# EAGLE design dc-isolation (EAGLE 5.07)
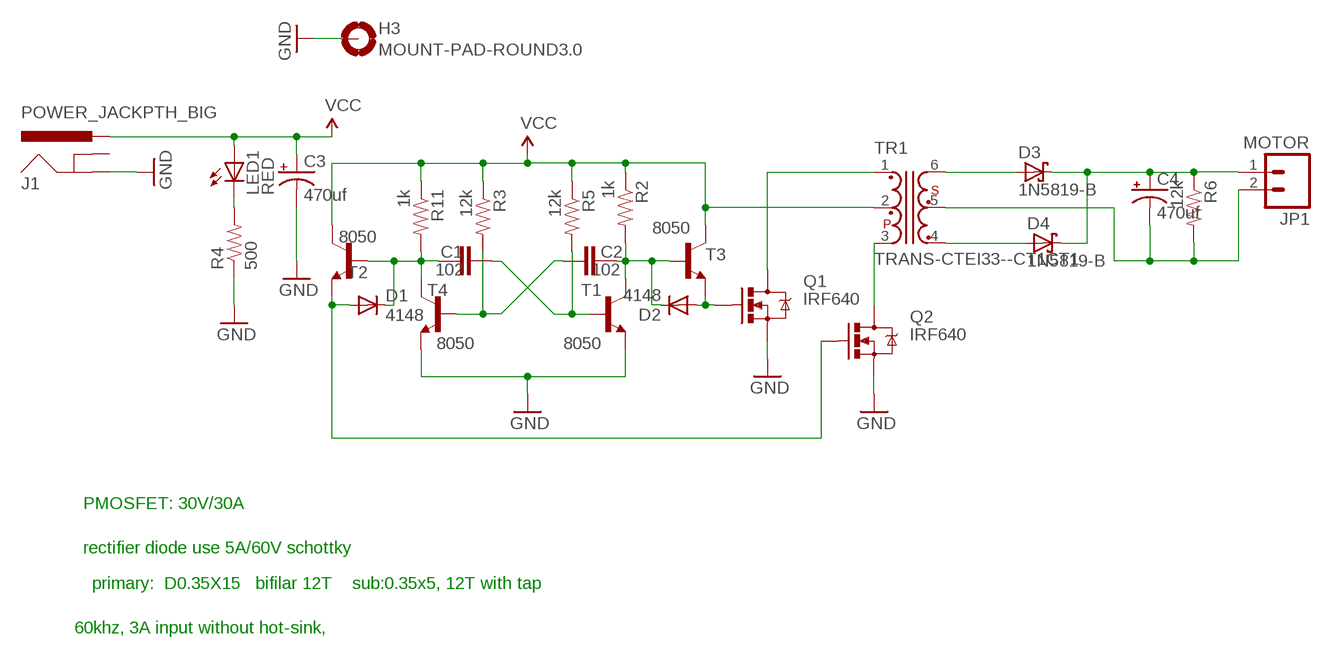
[diagram p0: schematic, sheet 1]

## Parts
C1  102  CAPPTH  [CAP-PTH-SMALL]
C2  102  CAPPTH  [CAP-PTH-SMALL]
C3  470uf  CAP_POLPTH1  [CPOL-RADIAL-100UF-25V]
C4  470uf  CAP_POLPTH1  [CPOL-RADIAL-100UF-25V]
D1  4148  DIODE1N4148  [DIODE-1N4148]
D2  4148  DIODE1N4148  [DIODE-1N4148]
D3  1N5819-B  [DO41-7.6]
D4  1N5819-B  [DO41-7.6]
H3  MOUNT-PAD-ROUND3.0  [3,0-PAD]
J1  POWER_JACKPTH_BIG  [POWER_JACK_2.1X5.5_BIG_PTH]
JP1  MOTOR  CON-02-XH  [XH-1X2-LONG-LOCK]
LED1  RED  LED3MM  [LED3MM]
Q1  IRF640  -MOSFET-N-TO220BV  [MOSFET-TO220BV]
Q2  IRF640  -MOSFET-N-TO220BV  [MOSFET-TO220BV]
R2  1k  RESISTOR1/4W  [AXIAL-0.3]
R3  12k  RESISTOR1/4W  [AXIAL-0.3]
R4  500  RESISTOR1/4W  [AXIAL-0.3]
R5  12k  RESISTOR1/4W  [AXIAL-0.3]
R6  12k  RESISTOR1/4W  [AXIAL-0.3]
R11  1k  RESISTOR1/4W  [AXIAL-0.3]
T1  8050  90**-NPN-TO92-EBC  [TO92-EBC]
T2  8050  90**-NPN-TO92-EBC  [TO92-EBC]
T3  8050  90**-NPN-TO92-EBC  [TO92-EBC]
T4  8050  90**-NPN-TO92-EBC  [TO92-EBC]
TR1  TRANS-CTEI33--CT1CT1  [EI33-PT1W-ST1W]

## Nets
GND: C3.2(-) H3.B3,0(MOUNT) J1.GND Q1.S Q2.S R4.P$1 T1.E T4.E
N$1: LED1.K(C) R4.P$2
N$2: D1.A Q2.G T2.E
N$3: Q1.D TR1.1
N$6: C1.1 D1.C R11.P$2 T2.B T4.C
N$7: Q2.D TR1.3
N$8: C2.1 R3.P$2 T4.B
N$9: C1.2 R5.P$2 T1.B
N$10: C2.2 D2.C R2.P$2 T1.C T3.B
N$11: D2.A Q1.G T3.E
N$13: D3.A TR1.6
N$14: C4.2(-) JP1.2 R6.P$2 TR1.5
N$15: C4.1(+) D3.C D4.C JP1.1 R6.P$1
N$16: D4.A TR1.4
VCC: C3.1(+) J1.PWR LED1.A R2.P$1 R3.P$1 R5.P$1 R11.P$1 T2.C T3.C TR1.2
Unconnected: J1.GNDBREAK

## Notes on the sheet
- PMOSFET: 30V/30A
- rectifier diode use 5A/60V schottky
- primary:  D0.35X15   bifilar 12T    sub:0.35x5, 12T with tap
- 60khz, 3A input without hot-sink,

## Library data of the parts
C1 C2 = digital-toy:CAP: Capacitor Standard 0603 ceramic capacitor, and 0.1" leaded capacitor.
C3 C4 = digital-toy:CAP_POL: Capacitor Polarized These are standard SMD and PTH capacitors. Normally 10uF, 47uF, and 100uF in electrolytic and tantalum varieties. Always verify the external diameter of the through hole cap, it varies with capacity, voltage, and manufacturer. The EIA devices should be standard. PANASONIC_D size: 6.5mmx6.5mmx5.5mm, 100uf (taobao:6.3mmx5.5mm), same as CVL0605 153cvl0405 size: 4mmx4mmx5.5mm, 10uf (taobao:4mmx5.5mm)
D1 D2 = digital-toy:DIODE: Diode These are standard reverse protection diodes and small signal diodes. SMA package can handle up to about 1A. SOD-323 can handle about 200mA. What the SOD-323 package when ordering, there are some mfgs out there that are 5-pin packages.
D3 D4 = digital-toy:1N581*: 1.0A SCHOTTKY BARRIER RECTIFIER Source: http://www.diodes.com/datasheets/ds23001.pdf
H3 = holes:MOUNT-PAD-ROUND: MOUNTING PAD, round
J1 = digital-toy:POWER_JACK: Power Jack This is the standard 5.5mm barrel jack for power. The PTH is the most common, proven, reliable, footprint. All others are experimental. The Slot footprint only works if the mill layer is transmitted to the PCB fab house so be warned. Spark Fun Electronics SKU : PRT-00119. Mating wall wart : TOL-00298 (and others)
JP1 = digital-toy:CON-02: Header 2 Standard 2-pin 0.1" header. Use with straight break away headers (SKU : PRT-00116), right angle break away headers (PRT-00553), swiss pins (PRT-00743), machine pins (PRT-00117), and female headers (PRT-00115). Molex polarized connector foot print use with SKU : PRT-08233 with associated crimp pins and housings.
LED1 = digital-toy:LED: LEDs Standard schematic elements and footprints for 5mm, 3mm, 1206, and 0603 sized LEDs. 5mm - Spark Fun Electronics SKU : COM-00529 (and others) copy led.lbr 0805 led here, by hyl digital-toy. 2010.6.29
Q1 Q2 = digital-toy:*-MOSFET-N
R2-R6 R11 = digital-toy:RESISTOR: Resistor Basic schematic elements and footprints for 0603, 1206, and PTH 1/10th watt (small) resistors. digital-toy copy vertical mount of axial-0.3 from rcl.lbr : the 0207/xx
T1-T4 = digital-toy:*-NPN-: NPN Transistror most of sot-23 use the pacages sot23-BEC, top C, left B, right E. by hyl, digital-toy. and to-92 use ebc(from-top) by hyl, digital-toy.
TR1 = digital-toy:TRANS-CT

## Board
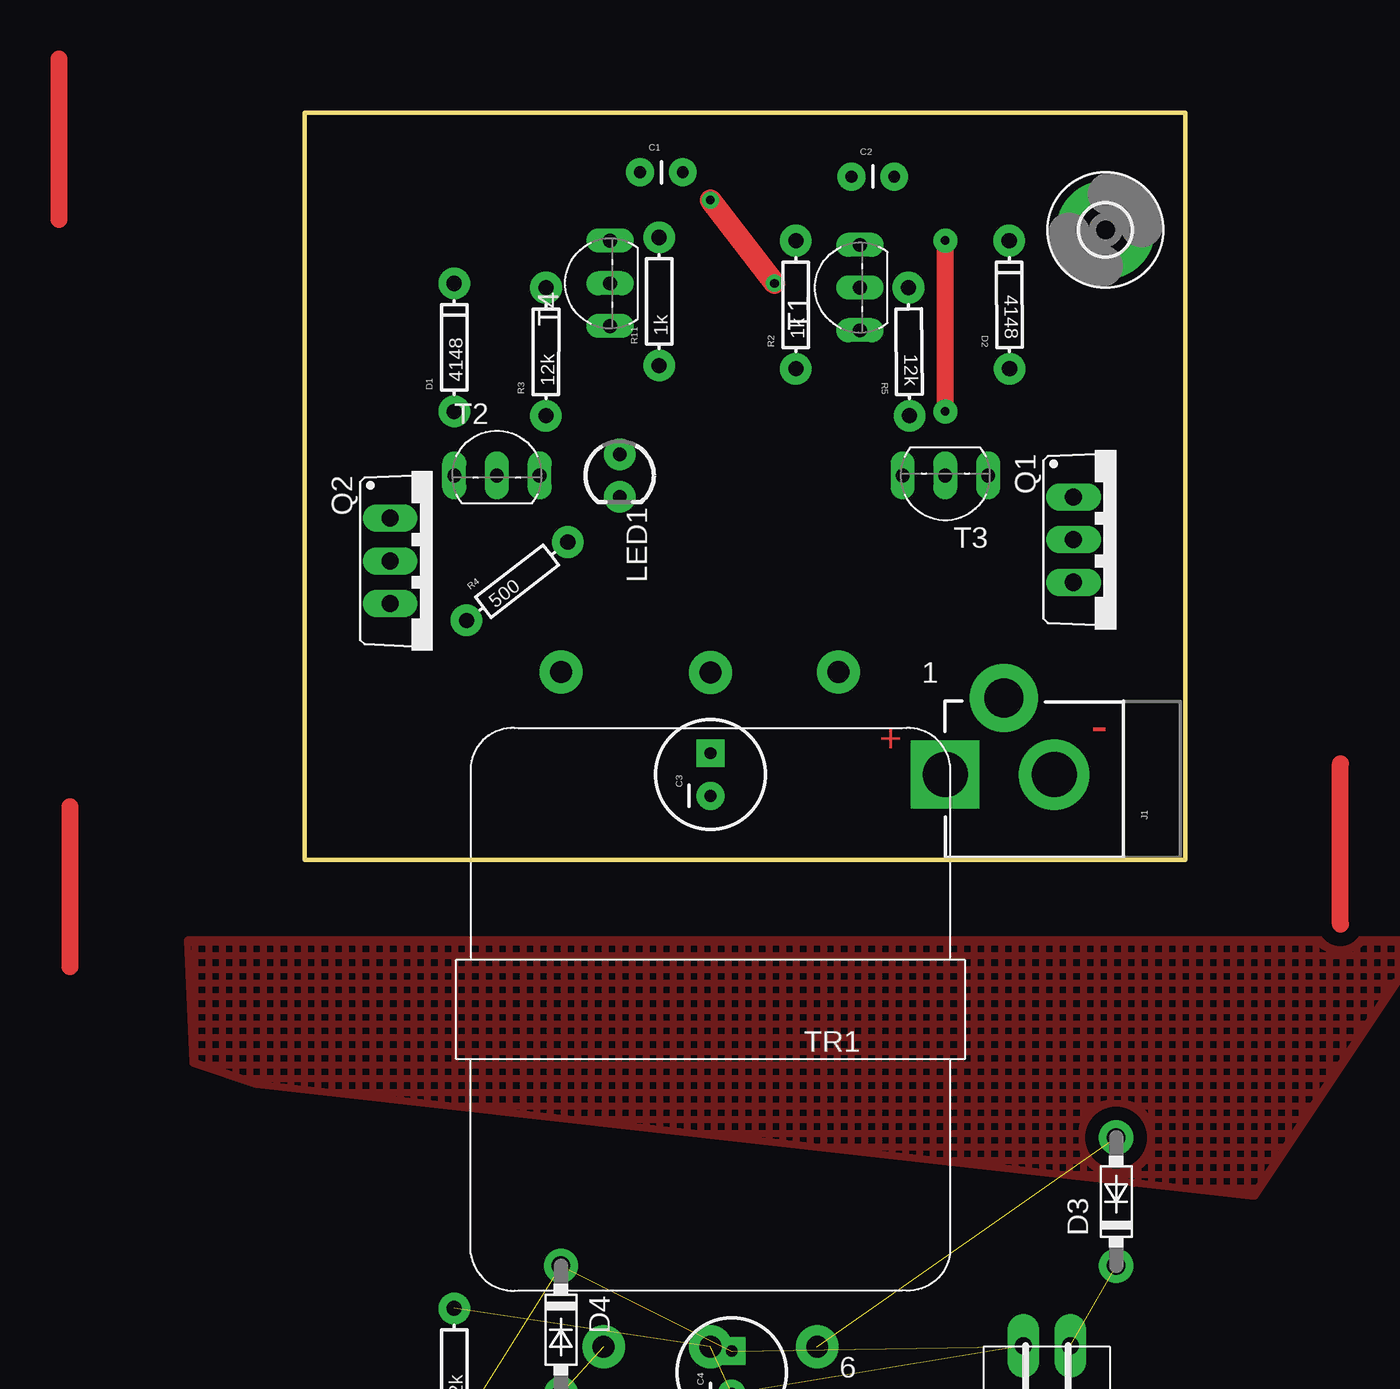
[diagram p1: board, top side]
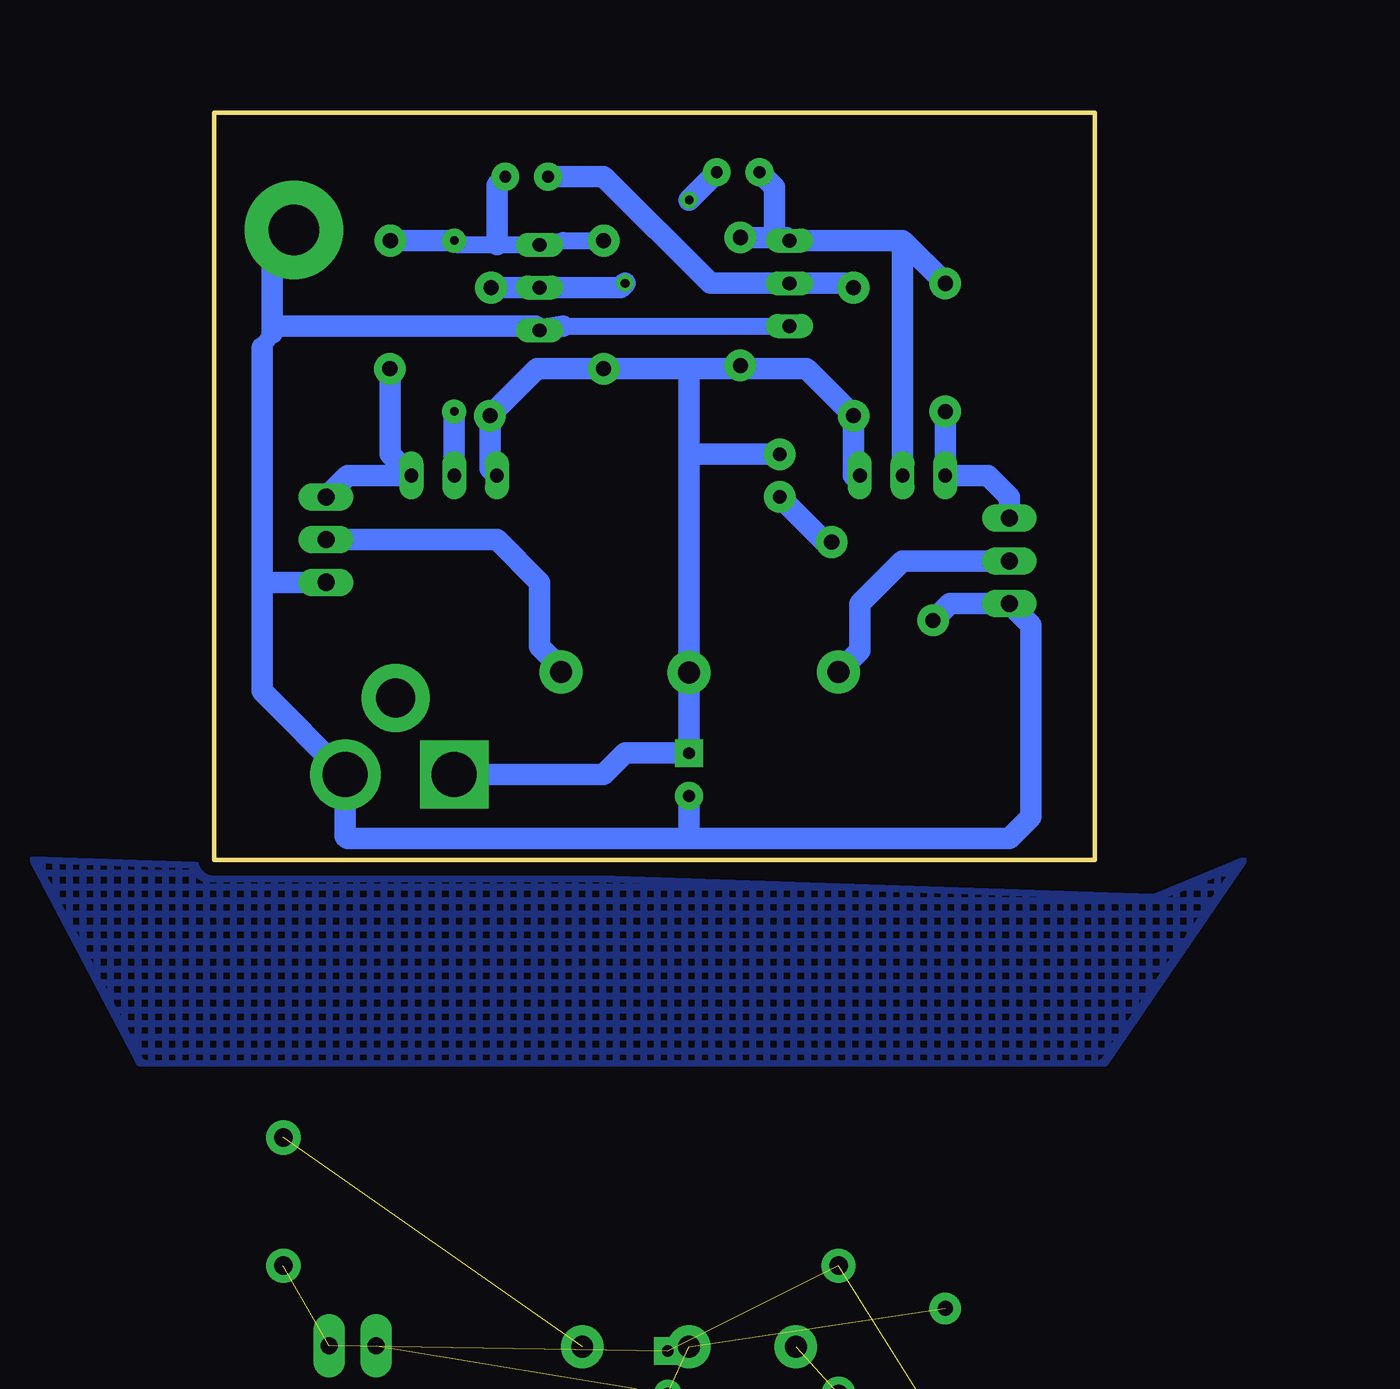
[diagram p2: board, bottom side, seen from below]

Size 52.39 x 44.45 mm. Coordinates in mm from the lower left corner, seen from the top.
Outline: 0,0 52.39,0 52.39,44.45 0,44.45 0,0
Copper layers (1*16): Top 0.035mm / dielectric 1.5mm / Bottom 0.035mm
Design rules "SparkFun-HP1007-600x600dpi": minimum track width 10mil, minimum drill 20mil, track to track 12mil, track to pad 12mil, pad to pad 12mil, via to via 12mil, smd to smd 12mil, copper to edge 12mil, drill to drill 12mil, minimum pad ring 12mil, minimum via ring 10mil, stop-mask expansion 4mil, vias tented up to drill 25mil, thermal gap 10mil

### Footprints (pad centres in the part's own frame; a part is rotated, then mirrored left to right if it is on the bottom)
CAP-PTH-SMALL = drill 0.7 pad 1.651 round: 1 0,0; 2 2.54,0
CPOL-RADIAL-100UF-25V = drill 0.7 pad 1.651 square: 1 1.27,0 | drill 0.7 pad 1.651 round: 2 -1.27,0
DIODE-1N4148 = drill 0.9 pad 1.88 round: A -3.81,0; C 3.81,0
DO41-7.6 = drill 1.1 pad 2.032 round: A 3.81,0; C -3.81,0
3,0-PAD = drill 3 pad 5.842 round: B3,0 0,0
POWER_JACK_2.1X5.5_BIG_PTH = drill 2.667 pad 4.191 round: GND 0,-0.127 | drill 2.337 pad 4.064 round: GNDBREAK 4.547,2.87 | drill 2.667 pad 4.064 square: PWR 0,6.35
XH-1X2-LONG-LOCK = drill 1.016 pad 1.88 long: 1 -1.397,0; 2 1.397,0
LED3MM = drill 0.813 pad 1.88 round: A -1.27,0; K 1.27,0
MOSFET-TO220BV = drill 1.016 long: D 0,-2.54; G -2.54,-2.54; S 2.54,-2.54
AXIAL-0.3 = drill 0.9 pad 1.88 round: P$1 -3.81,0; P$2 3.81,0
TO92-EBC = drill 0.813 long: B 0,-1.27; C 2.54,-1.27; E -2.54,-1.27
EI33-PT1W-ST1W = drill 1.3 pad 2.54 round: 1 -7.62,-20.066; 2 0,-20.038; 3 8.89,-20.066; 4 6.35,20.066; 5 0,20.066; 6 -6.35,20.066

### Placement (x,y rotation side)
C1  19.94,40.89 0 top
C2  32.51,40.64 0 top
C3  24.13,5.08 90 top
C4  25.4,-30.48 90 top  (outside the outline)
D1  8.89,30.48 90 top
D2  41.91,33.02 90.2 top
D3  48.26,-20.32 90 top  (outside the outline)
D4  15.24,-27.94 270 top  (outside the outline)
H3  47.62,37.47 0 top
J1  44.45,5.08 90 top
JP1  44.13,-28.89 180 top  (outside the outline)
LED1  18.73,22.86 270 top
Q1  48.26,19.05 270 top
Q2  7.62,17.78 270 top
R2  29.21,33.02 90 top
R3  14.35,30.23 89.9 top
R4  12.64,16.57 37.7 top
R5  35.94,30.23 90.5 top
R6  8.89,-30.48 90 top  (outside the outline)
R11  21.08,33.21 90 top
T1  31.75,34.04 90 top
T2  11.43,24.13 0 top
T3  38.1,21.59 180 top
T4  16.89,34.29 90 top
TR1  24.13,-8.89 180 top

### Tracks (layer width: path | path; a pad name or v marks a point on that pad's centre or on a via)
GND
  Bottom 1.016: 31.62,31.75 T4.E | 49.53,30.48 48.93,31.33
  Bottom 1.27: 31.62,31.75 T1.E 33.27,31.75 48.93,31.75 | 49.53,16.51 Q1.S | 49.53,16.51 49.53,30.48 | 49.53,16.51 49.53,10.03 J1.GND 44.58,1.4 44.45,1.27 24.13,1.27 | 24.13,1.27 5.08,1.27 3.81,2.54 3.81,13.97 Q2.S 8.62,15.24 R4.P$1 | 24.13,1.27 C3.2 | H3.B3,0 48.93,36.16 48.93,31.75 | 48.93,31.33 48.93,31.75
  pour Bottom (isolate 0.813, hatched): -3.49,-2.22 63.18,0 56.83,-12.06 -0.64,-12.06 -8.89,0
  pour Top (isolate 0.813, hatched): 56.52,-20 66.67,-4.76 -6.99,-4.76 -6.67,-12.06 -2.86,-13.34
N$1
  Bottom 1.27: R4.P$2 16.05,18.9 LED1.K
N$2
  Bottom 1.27: D1.A T2.E 6.35,22.86 5.08,21.59 Q2.G
N$3
  Bottom 1.27: Q1.D 35.56,19.05 33.02,16.51 33.02,12.7 31.75,11.43 TR1.1
N$6
  Bottom 1.27: T2.B 11.43,36.83 | 11.43,36.83 T4.C 18.35,37.02 19.05,37.02 | 11.43,36.83 D1.C | 19.05,37.02 R11.P$2 | C1.1 19.05,40.01 19.05,37.02
N$7
  Bottom 1.27: Q2.D 11.43,17.78 13.97,15.24 13.97,12.45 TR1.3
N$8
  Bottom 1.27: R3.P$2 14.61,34.29 T4.B 22.86,34.29 29.21,40.64 C2.1
N$9  (via drill 0.51)
  Top 1.27: v24.13,39.24 v27.94,34.29
  Bottom 1.27: R5.P$2 T1.B 28.19,34.04 v27.94,34.29 | C1.2 v24.13,39.24
N$10  (via drill 0.51 pad 1.42)
  Top 1.016: v38.1,26.67 v38.1,36.83
  Bottom 1.016: v38.1,36.83 37.85,36.58 35.56,36.58 T1.C 31.62,36.83 R2.P$2
  Bottom 1.27: T3.B v38.1,26.67 | v38.1,36.83 D2.C | v38.1,36.83 | C2.2 35.56,40.13 35.56,36.58
N$11
  Bottom 1.27: D2.A 41.92,24.14 T3.E 44.45,22.86 Q1.G
N$13  (1 unrouted)
N$14  (3 unrouted)
N$15  (4 unrouted)
N$16  (1 unrouted)
N$18
  Top 1.016: -14.61,38.1 -14.61,47.62
N$26
  Top 1.016: 61.59,-3.81 61.59,5.71
N$28
  Top 1.016: -13.97,3.17 -13.97,-6.35
VCC
  Bottom 1.27: 24.13,24.13 TR1.2 C3.1 27.94,6.35 29.21,5.08 J1.PWR | 24.13,24.13 24.13,29.21 | 24.13,29.21 R2.P$1 33.18,29.21 R5.P$1 35.97,23.27 T3.C | 21.08,29.21 R11.P$1 | 24.13,29.21 21.08,29.21 | T2.C 14.34,22.86 R3.P$1 17.14,29.21 21.08,29.21 | 24.13,24.13 LED1.A

### Text on the board
Top: - | +